# EAGLE schematic ashield (EAGLE 5.11)
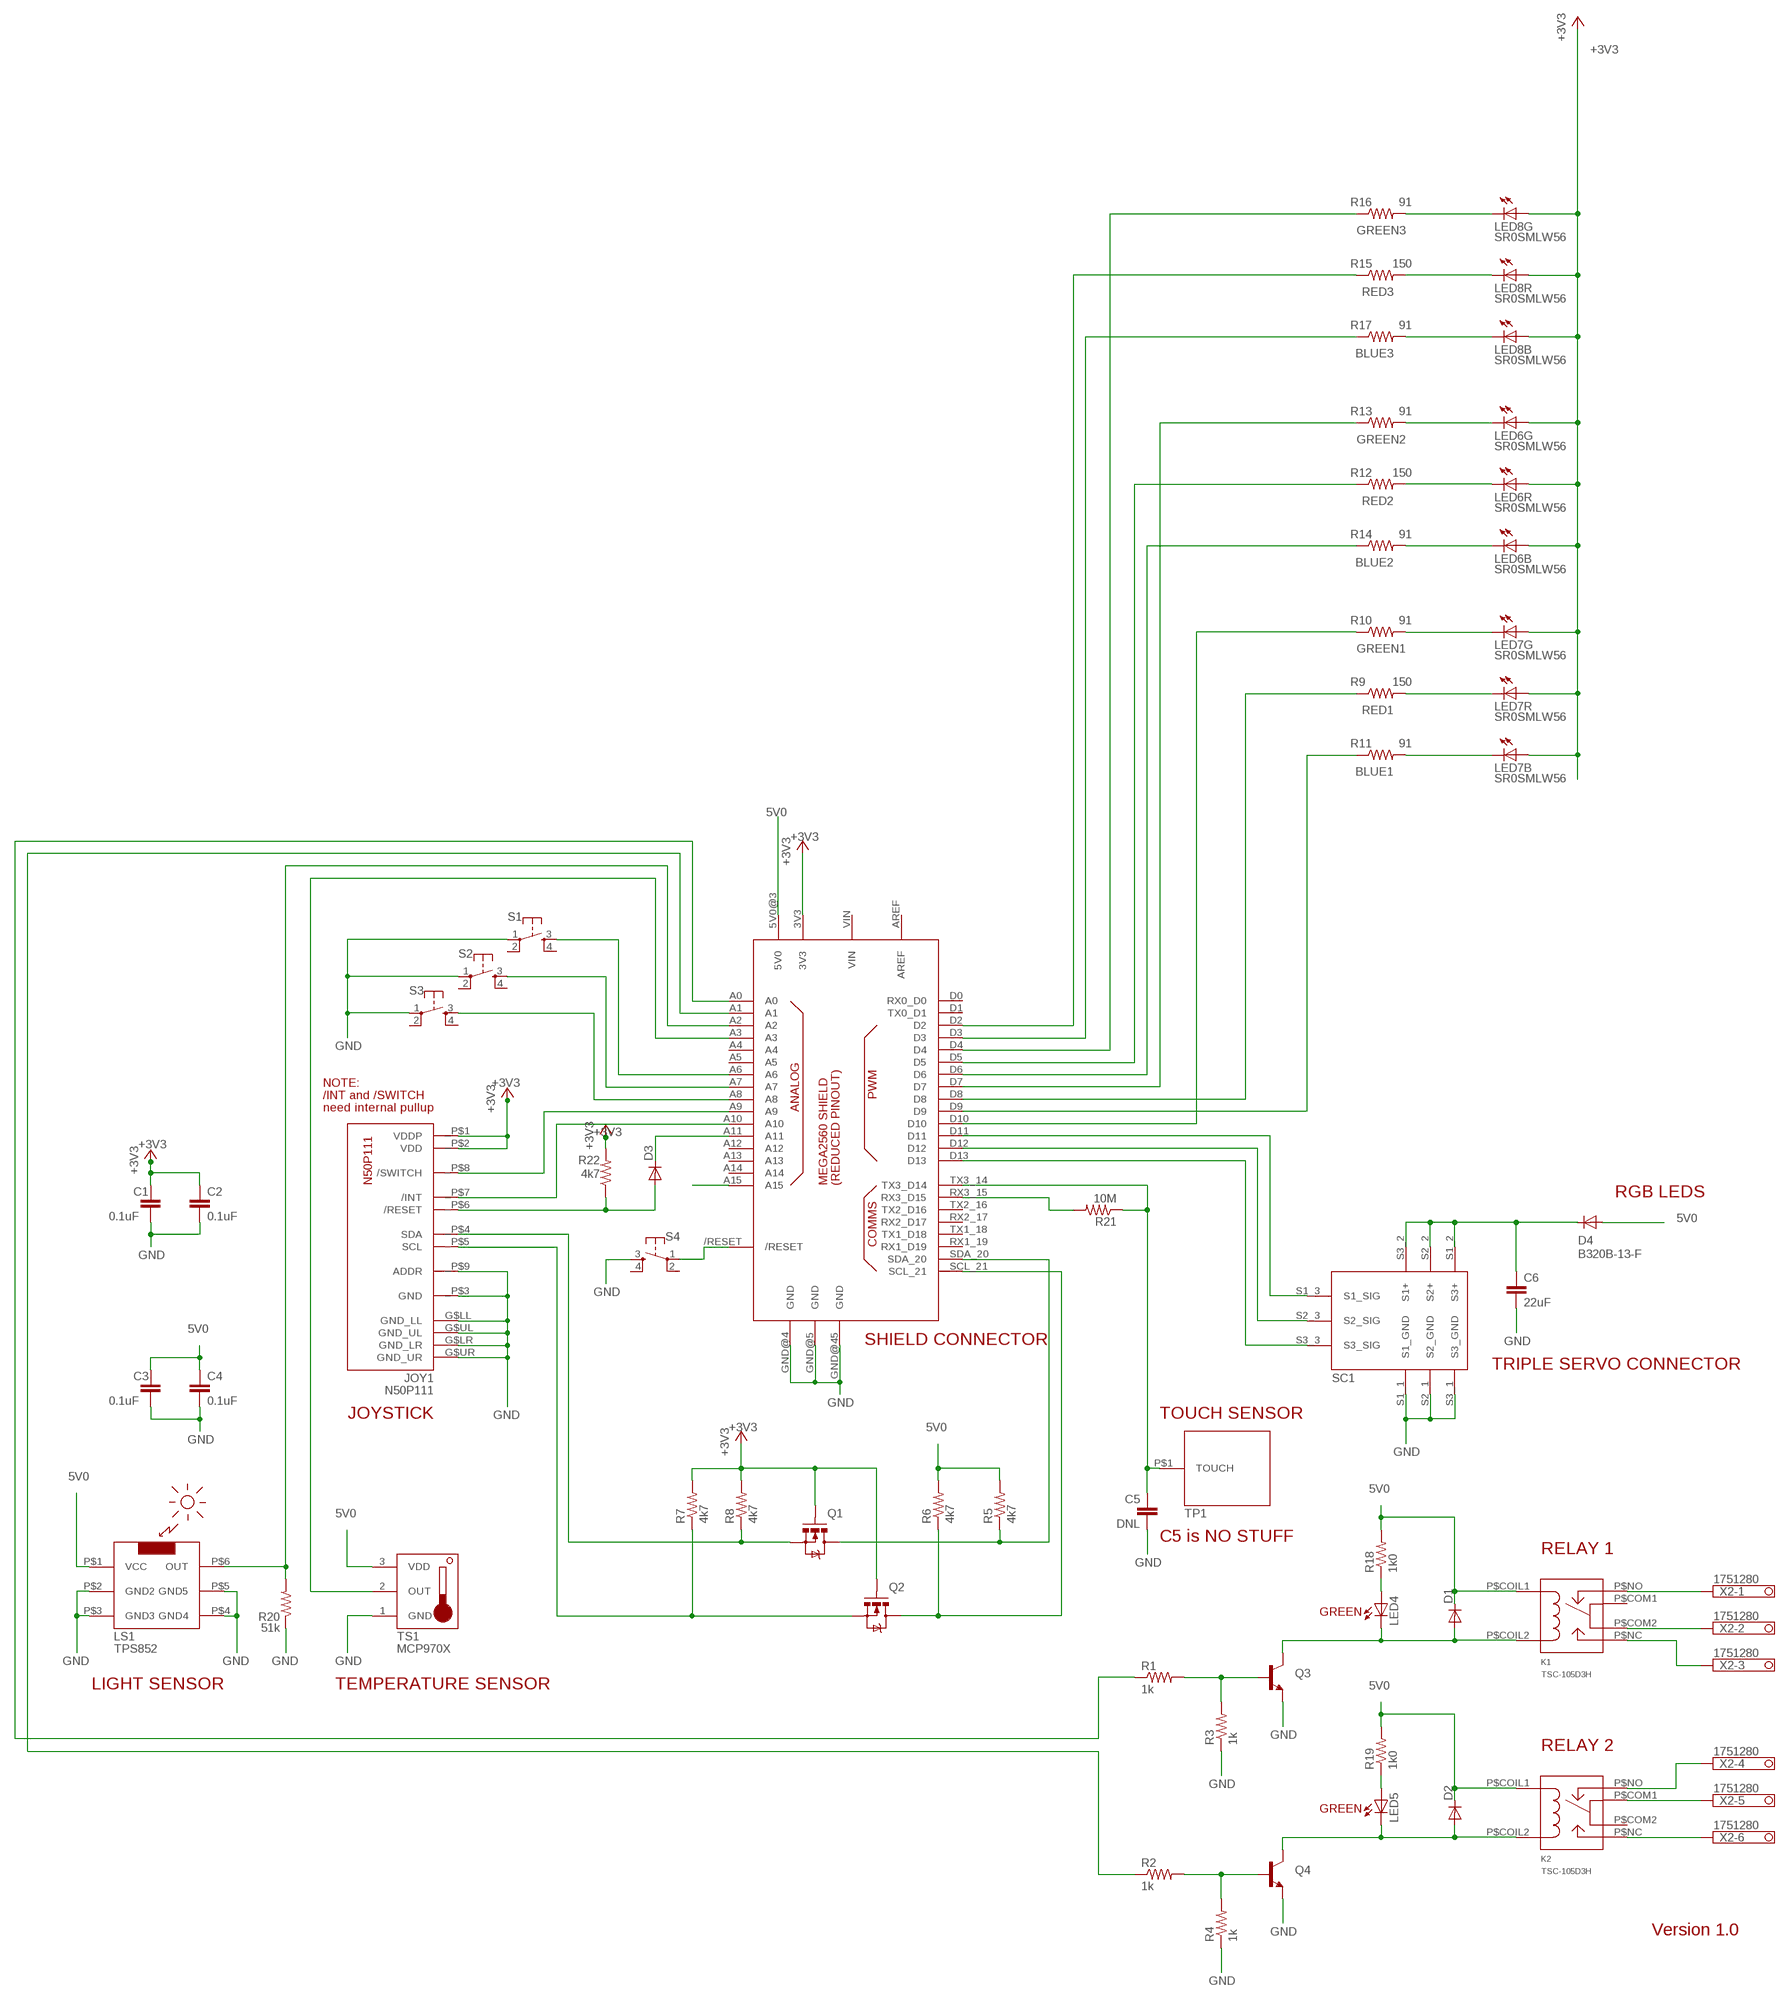
[diagram p0: schematic, sheet 1, part 1 of 2]
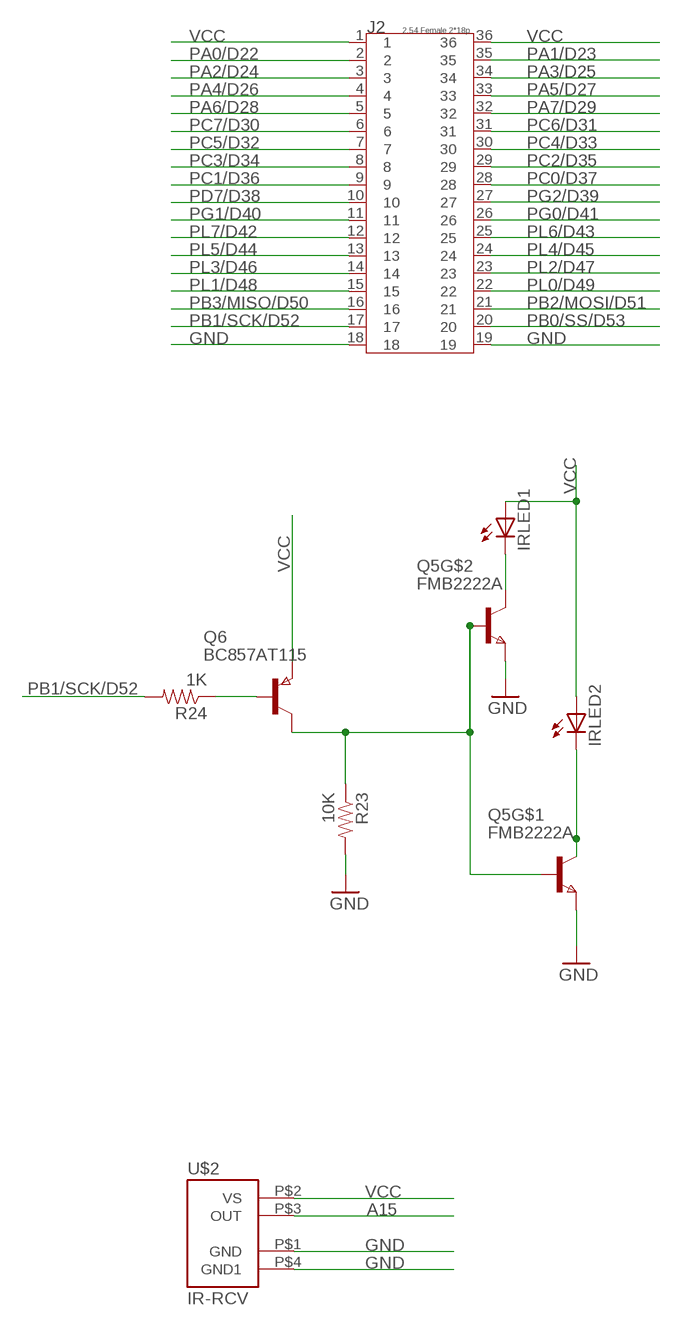
[diagram p1: schematic, sheet 1, part 2 of 2]

## Parts
BOARD1  MEGAARDUINO_REDUCED  [MEGA_ARDUINO_REDUCED]
C1  0.1uF  CAP0603-CAP  [0603-CAP]
C2  0.1uF  CAP0603-CAP  [0603-CAP]
C3  0.1uF  CAP0603-CAP  [0603-CAP]
C4  0.1uF  CAP0603-CAP  [0603-CAP]
C5  DNL  CAP0603-CAP  [0603-CAP]
C6  22uF  CAP1206  [1206]
D1  DIODESOD  [SOD-323]
D2  DIODESOD  [SOD-323]
D3  DIODESOD  [SOD-323]
D4  B320B-13-F  DIODESMA  [SMA-DIODE]
IRLED1  LED5MM  [LED5MM]
IRLED2  LED5MM  [LED5MM]
J2  2.54 Female 2*18p  HEADER-2X18P  [2.54-2X18P]
JOY1  N50P111  [N50P111]
K1  TSC-105D3H  [TSC-105D3H]
K2  TSC-105D3H  [TSC-105D3H]
LED4  LEDCHIPLED_0603  [CHIPLED_0603]
LED5  LEDCHIPLED_0603  [CHIPLED_0603]
LED6  SR0SMLW56  LP2C63-ST-RGB-SR0SMLW56  [SMLW56]
LED7  SR0SMLW56  LP2C63-ST-RGB-SR0SMLW56  [SMLW56]
LED8  SR0SMLW56  LP2C63-ST-RGB-SR0SMLW56  [SMLW56]
LS1  TPS852  [TPS852]
Q1  MOSFET-NCHANNELSMD  [SOT23-3]
Q2  MOSFET-NCHANNELSMD  [SOT23-3]
Q3  TRANSISTOR_NPNSOT23-3  [SOT23-3]
Q4  TRANSISTOR_NPNSOT23-3  [SOT23-3]
Q5  FMB2222A  DUALNPN  [SSOT6]
Q6  BC857AT115  PNPSOT323SOT416  [SOT416]
R1  1k  RESISTOR0402-RES  [0402-RES]
R2  1k  RESISTOR0402-RES  [0402-RES]
R3  1k  RESISTOR0402-RES  [0402-RES]
R4  1k  RESISTOR0402-RES  [0402-RES]
R5  4k7  RESISTOR0402-RES  [0402-RES]
R6  4k7  RESISTOR0402-RES  [0402-RES]
R7  4k7  RESISTOR0402-RES  [0402-RES]
R8  4k7  RESISTOR0402-RES  [0402-RES]
R9  150  RESISTOR0402-RES  [0402-RES]
R10  91  RESISTOR0402-RES  [0402-RES]
R11  91  RESISTOR0402-RES  [0402-RES]
R12  150  RESISTOR0402-RES  [0402-RES]
R13  91  RESISTOR0402-RES  [0402-RES]
R14  91  RESISTOR0402-RES  [0402-RES]
R15  150  RESISTOR0402-RES  [0402-RES]
R16  91  RESISTOR0402-RES  [0402-RES]
R17  91  RESISTOR0402-RES  [0402-RES]
R18  1k0  RESISTOR0402-RES  [0402-RES]
R19  1k0  RESISTOR0402-RES  [0402-RES]
R20  51k  RESISTOR0402-RES  [0402-RES]
R21  10M  RESISTOR0402-RES  [0402-RES]
R22  4k7  RESISTOR0402-RES  [0402-RES]
R23  10K  RESISTOR  [0805]
R24  1K  RESISTOR  [0805]
S1  B3S-1000  [B3S-10XX]
S2  B3S-1000  [B3S-10XX]
S3  B3S-1000  [B3S-10XX]
S4  B3S-1000  [B3S-10XX]
SC1  3SERVOS  [3SERVOS]
TP1  ROBOT_TOUCHPADBARE  [ROBOT_50_TP_BARE]
TS1  MCP970X  [TO92]
U$2  IR-RCV  [IR-RCV]
X2  1751280  [1751280]

## Nets
5V0: BOARD1.5V0@3(5V0) C3.1 C4.1 D1.1(C) D2.1(C) D4.A K1.P$COIL1(COIL1) K2.P$COIL1(COIL1) LS1.P$1(VCC) R5.2 R6.2 R18.2 R19.2 TS1.3(VDD)
+3V3: BOARD1.3V3 C1.1 C2.1 JOY1._P$1(VDDP) JOY1._P$2(VDD) LED6.1(G:A) LED6.2(R:A) LED6.3(B:A) LED7.1(G:A) LED7.2(R:A) LED7.3(B:A) LED8.1(G:A) LED8.2(R:A) LED8.3(B:A) Q1.1(G) Q2.1(G) R7.2 R8.2 R22.2
/JOYINT: BOARD1.A10 JOY1._P$7(/INT)
/JOYSWITCH: BOARD1.A9 JOY1._P$8(/SWITCH)
A15: BOARD1.A15 U$2.P$3(OUT)
BLUE1: BOARD1.D9 R11.1
BLUE2: BOARD1.D6 R14.1
BLUE3: BOARD1.D3 R17.1
GND: BOARD1.GND@4(GND) BOARD1.GND@5(GND) BOARD1.GND@45(GND) C1.2 C2.2 C3.2 C4.2 C5.2 C6.2 J2.18 J2.19 JOY1._P$3(GND) JOY1._P$9(ADDR) JOY1.G$LL(GND_LL) JOY1.G$LR(GND_LR) JOY1.G$UL(GND_UL) JOY1.G$UR(GND_UR) LS1.P$2(GND2) LS1.P$3(GND3) LS1.P$4(GND4) LS1.P$5(GND5) Q3.2(E) Q4.2(E) Q5.2(E) Q5.5(E) R3.1 R4.1 R20.1 R23.2 S1.1(P) S2.1(P) S3.1(P) S4.3(S) SC1.S1_1(S1_GND) SC1.S2_1(S2_GND) SC1.S3_1(S3_GND) TS1.1(GND) U$2.P$1(GND) U$2.P$4(GND1)
GREEN1: BOARD1.D10 R10.1
GREEN2: BOARD1.D7 R13.1
GREEN3: BOARD1.D4 R16.1
K1_COM: K1.P$COM2(COM2) X2.2
K2_COM: K2.P$COM1(COM1) X2.5
LIGHT_VOLT: BOARD1.A2 LS1.P$6(OUT) R20.2
N$1: BOARD1./RESET S4.1(P)
N$2: LED8.6(G:C) R16.2
N$3: LED8.5(R:C) R15.2
N$4: LED8.4(B:C) R17.2
N$5: LED6.6(G:C) R13.2
N$6: LED6.5(R:C) R12.2
N$7: LED6.4(B:C) R14.2
N$8: LED7.6(G:C) R10.2
N$9: LED7.5(R:C) R9.2
N$10: LED7.4(B:C) R11.2
N$11: BOARD1.A6 S1.3(S)
N$12: BOARD1.A7 S2.3(S)
N$13: BOARD1.A8 S3.3(S)
N$14: BOARD1.RX3_15(RX3_D15) R21.2
N$15: D1.2(A) K1.P$COIL2(COIL2) LED4.C Q3.3(C)
N$16: D2.2(A) K2.P$COIL2(COIL2) LED5.C Q4.3(C)
N$17: BOARD1.TX3_14(TX3_D14) C5.1 R21.1 TP1.P$1(TOUCH)
N$18: C6.1 D4.C SC1.S1_2(S3+) SC1.S2_2(S2+) SC1.S3_2(S1+)
N$19: D3.2(A) JOY1._P$6(/RESET) R22.1
N$20: BOARD1.A11 D3.1(C)
N$21: K1.P$NO(NO) X2.1
N$22: K1.P$NC(NC) X2.3
N$23: K2.P$NC(NC) X2.6
N$24: K2.P$NO(NO) X2.4
N$25: Q3.1(B) R1.2 R3.2
N$26: Q4.1(B) R2.2 R4.2
N$27: Q5.1(B) Q5.3(B) Q6.1(C) R23.1
N$28: Q6.2(B) R24.1
N$29: LED4.A R18.1
N$30: LED5.A R19.1
N$31: IRLED1.K(C) Q5.4(C)
N$32: IRLED2.K(C) Q5.6(C)
PA0/D22: J2.2
PA1/D23: J2.35
PA2/D24: J2.3
PA3/D25: J2.34
PA4/D26: J2.4
PA5/D27: J2.33
PA6/D28: J2.5
PA7/D29: J2.32
PB0/SS/D53: J2.20
PB1/SCK/D52: J2.17 R24.2
PB2/MOSI/D51: J2.21
PB3/MISO/D50: J2.16
PC0/D37: J2.28
PC1/D36: J2.9
PC2/D35: J2.29
PC3/D34: J2.8
PC4/D33: J2.30
PC5/D32: J2.7
PC6/D31: J2.31
PC7/D30: J2.6
PD7/D38: J2.10
PG0/D41: J2.26
PG1/D40: J2.11
PG2/D39: J2.27
PL0/D49: J2.22
PL1/D48: J2.15
PL2/D47: J2.23
PL3/D46: J2.14
PL4/D45: J2.24
PL5/D44: J2.13
PL6/D43: J2.25
PL7/D42: J2.12
RED1: BOARD1.D8 R9.1
RED2: BOARD1.D5 R12.1
RED3: BOARD1.D2 R15.1
RELAY1: BOARD1.A0 R1.1
RELAY2: BOARD1.A1 R2.1
SCL_3V3: JOY1._P$5(SCL) Q2.2(S) R7.1
SCL_5V: BOARD1.SCL_21 Q2.3(D) R6.1
SDA_3V3: JOY1._P$4(SDA) Q1.2(S) R8.1
SDA_5V: BOARD1.SDA_20 Q1.3(D) R5.1
SERVO1: BOARD1.D11 SC1.S1_3(S1_SIG)
SERVO2: BOARD1.D12 SC1.S2_3(S2_SIG)
SERVO3: BOARD1.D13 SC1.S3_3(S3_SIG)
TEMP_1WIRE: BOARD1.A3 TS1.2(OUT)
VCC: IRLED1.A IRLED2.A J2.1 J2.36 Q6.3(E) U$2.P$2(VS)
Unconnected: BOARD1.A4 BOARD1.A5 BOARD1.A12 BOARD1.A13 BOARD1.A14 BOARD1.D0(RX0_D0) BOARD1.D1(TX0_D1) BOARD1.RX1_19(RX1_D19) BOARD1.RX2_17(RX2_D17) BOARD1.TX1_18(TX1_D18) BOARD1.TX2_16(TX2_D16) K1.P$COM1(COM1) K2.P$COM2(COM2) S1.2(P1) S1.4(S1) S2.2(P1) S2.4(S1) S3.2(P1) S3.4(S1) S4.2(P1) S4.4(S1)

## Notes on the sheet
- NOTE:
- /INT and /SWITCH
- need internal pullup
- RGB LEDS
- SHIELD CONNECTOR
- TRIPLE SERVO CONNECTOR
- JOYSTICK | TOUCH SENSOR
- C5 is NO STUFF
- RELAY 1
- GREEN
- LIGHT SENSOR | TEMPERATURE SENSOR
- RELAY 2
- GREEN
- Version 1.0

## Power pins joined to a net without a drawn wire
AREF: BOARD1.AREF
VIN: BOARD1.VIN

## Library data of the parts
BOARD1 = ashield:MEGAARDUINO_REDUCED
C1-C6 = SparkFun:CAP: Capacitor Standard 0603 ceramic capacitor, and 0.1" leaded capacitor.
D1-D4 = SparkFun:DIODE: Diode These are standard reverse protection diodes and small signal diodes. SMA package can handle up to about 1A. SOD-323 can handle about 200mA. What the SOD-323 package when ordering, there are some mfgs out there that are 5-pin packages.
IRLED1 IRLED2 LED4 LED5 = led:LED: LED OSRAM: - CHIPLED LG R971, LG N971, LY N971, LG Q971, LY Q971, LO R971, LY R971 LH N974, LH R974 LS Q976, LO Q976, LY Q976 LO Q996 - Hyper CHIPLED LW Q18S LB Q993, LB Q99A, LB R99A - SideLED LS A670, LO A670, LY A670, LG A670, LP A670 LB A673, LV A673, LT A673, LW A673 LH A674 LY A675 LS A676, LA A676, LO A676, LY A676, LW A676 LS A679, LY A679, LG A679 - Hyper Micro SIDELED® LS Y876, LA Y876, LO Y876, LY Y876 LT Y87S - SmartLED LW L88C, LW L88S LB L89C, LB L89S, LG L890 LS L89K, LO L89K, LY L89K LS L896, LA L896, LO L896, LY L896 - TOPLED LS T670, LO T670, LY T670, LG T670, LP T670 LSG T670, LSP T670, LSY T670, LOP T670, LYG T670 LG T671, LOG T671, LSG T671 LB T673, LV T673, LT T673, LW T673 LH T674 LS T676, LA T676, LO T676, LY T676, LB T676, LH T676, LSB T676, LW T676 LB T67C, LV T67C, LT T67C, LS T67K, LO T67K, LY T67K, LW E67C LS E67B, LA E67B, LO E67B, LY E67B, LB E67C, LV E67C, LT E67C LW T67C LS T679, LY T679, LG T679 LS T770, LO T770, LY T770, LG T770, LP T770 LB T773, LV T773, LT T773, LW T773 LH T774 LS E675, LA E675, LY E675, LS T675 LS T776, LA T776, LO T776, LY T776, LB T776 LHGB T686 LT T68C, LB T68C - Hyper Mini TOPLED® LB M676 - Mini TOPLED Santana® LG M470 LS M47K, LO M47K, LY M47K Source: http://www.osram.convergy.de LUXEON: - LUMILED® LXK2-PW12-R00, LXK2-PW12-S00, LXK2-PW14-U00, LXK2-PW14-V00 LXK2-PM12-R00, LXK2-PM12-S00, LXK2-PM14-U00 LXK2-PE12-Q00, LXK2-PE12-R00, LXK2-PE12-S00, LXK2-PE14-T00, LXK2-PE14-U00 LXK2-PB12-K00, LXK2-PB12-L00, LXK2-PB12-M00, LXK2-PB14-N00, LXK2-PB14-P00, LXK2-PB14-Q00 LXK2-PR12-L00, LXK2-PR12-M00, LXK2-PR14-Q00, LXK2-PR14-R00 LXK2-PD12-Q00, LXK2-PD12-R00, LXK2-PD12-S00 LXK2-PH12-R00, LXK2-PH12-S00 LXK2-PL12-P00, LXK2-PL12-Q00, LXK2-PL12-R00 Source: www.luxeon.com KINGBRIGHT: KA-3528ASYC Source: www.kingbright.com
J2 = Connector:HEADER-2X18P
JOY1 = AustriaMicro:N50P111
K1 K2 = Relay_Type:TSC-105D3H
LED6-LED8 = led:LP2C63-ST-RGB-SR0: 1.5W RGB HIGH POWER LED Source: http://www.ledtech.com.tw .. LP2C63-ST-RGB-SR0.SPEC.pdf
LS1 = toshiba_light_sensor:TPS852
Q1 Q2 = SparkFun:MOSFET-NCHANNEL
Q3 Q4 = SparkFun:TRANSISTOR_NPN: Transistor NPN BJT configuration in SOT23 package. MMBT2222 is the common NPN we use. Double check BCE configuration again layout.
Q5 = fairchild-semic:DUALNPN
Q6 = zetex:PNPSOT323: PNP TRANSISTOR
R1-R24 = SparkFun:RESISTOR: Resistor Basic schematic elements and footprints for 0603, 1206, and PTH 1/10th watt (small) resistors.
S1-S4 = switch-omron:B3S-1000: Omron Surface Mount Switch, 160g operating force, 4.3mm actuator height, sealed for immersion cleaning
SC1 = servocon:3SERVOS
TP1 = logos:ROBOT_TOUCHPAD
TS1 = microchip_temp:MCP970X
U$2 = IR-rcv:IR-RCV
X2 = con-phoenix-350:1751280: MKDS 1/ 6-3,5 Printklemme Nennstrom: 10 A Bemessungsspannung: 160 V Raster: 3,5 mm Polzahl: 6 Montageart: Löten Anschlussart: Schraubanschluss Anschlussrichtung vom Leiter zur Platine: 0° Source: http://eshop.phoenixcontact.com .. 1751280.pdf; MPN: 1751280; OC_FARNELL: unknown; OC_NEWARK: 27R1765